# EAGLE design Jetson Nano without CAN (EAGLE 9.6.2)
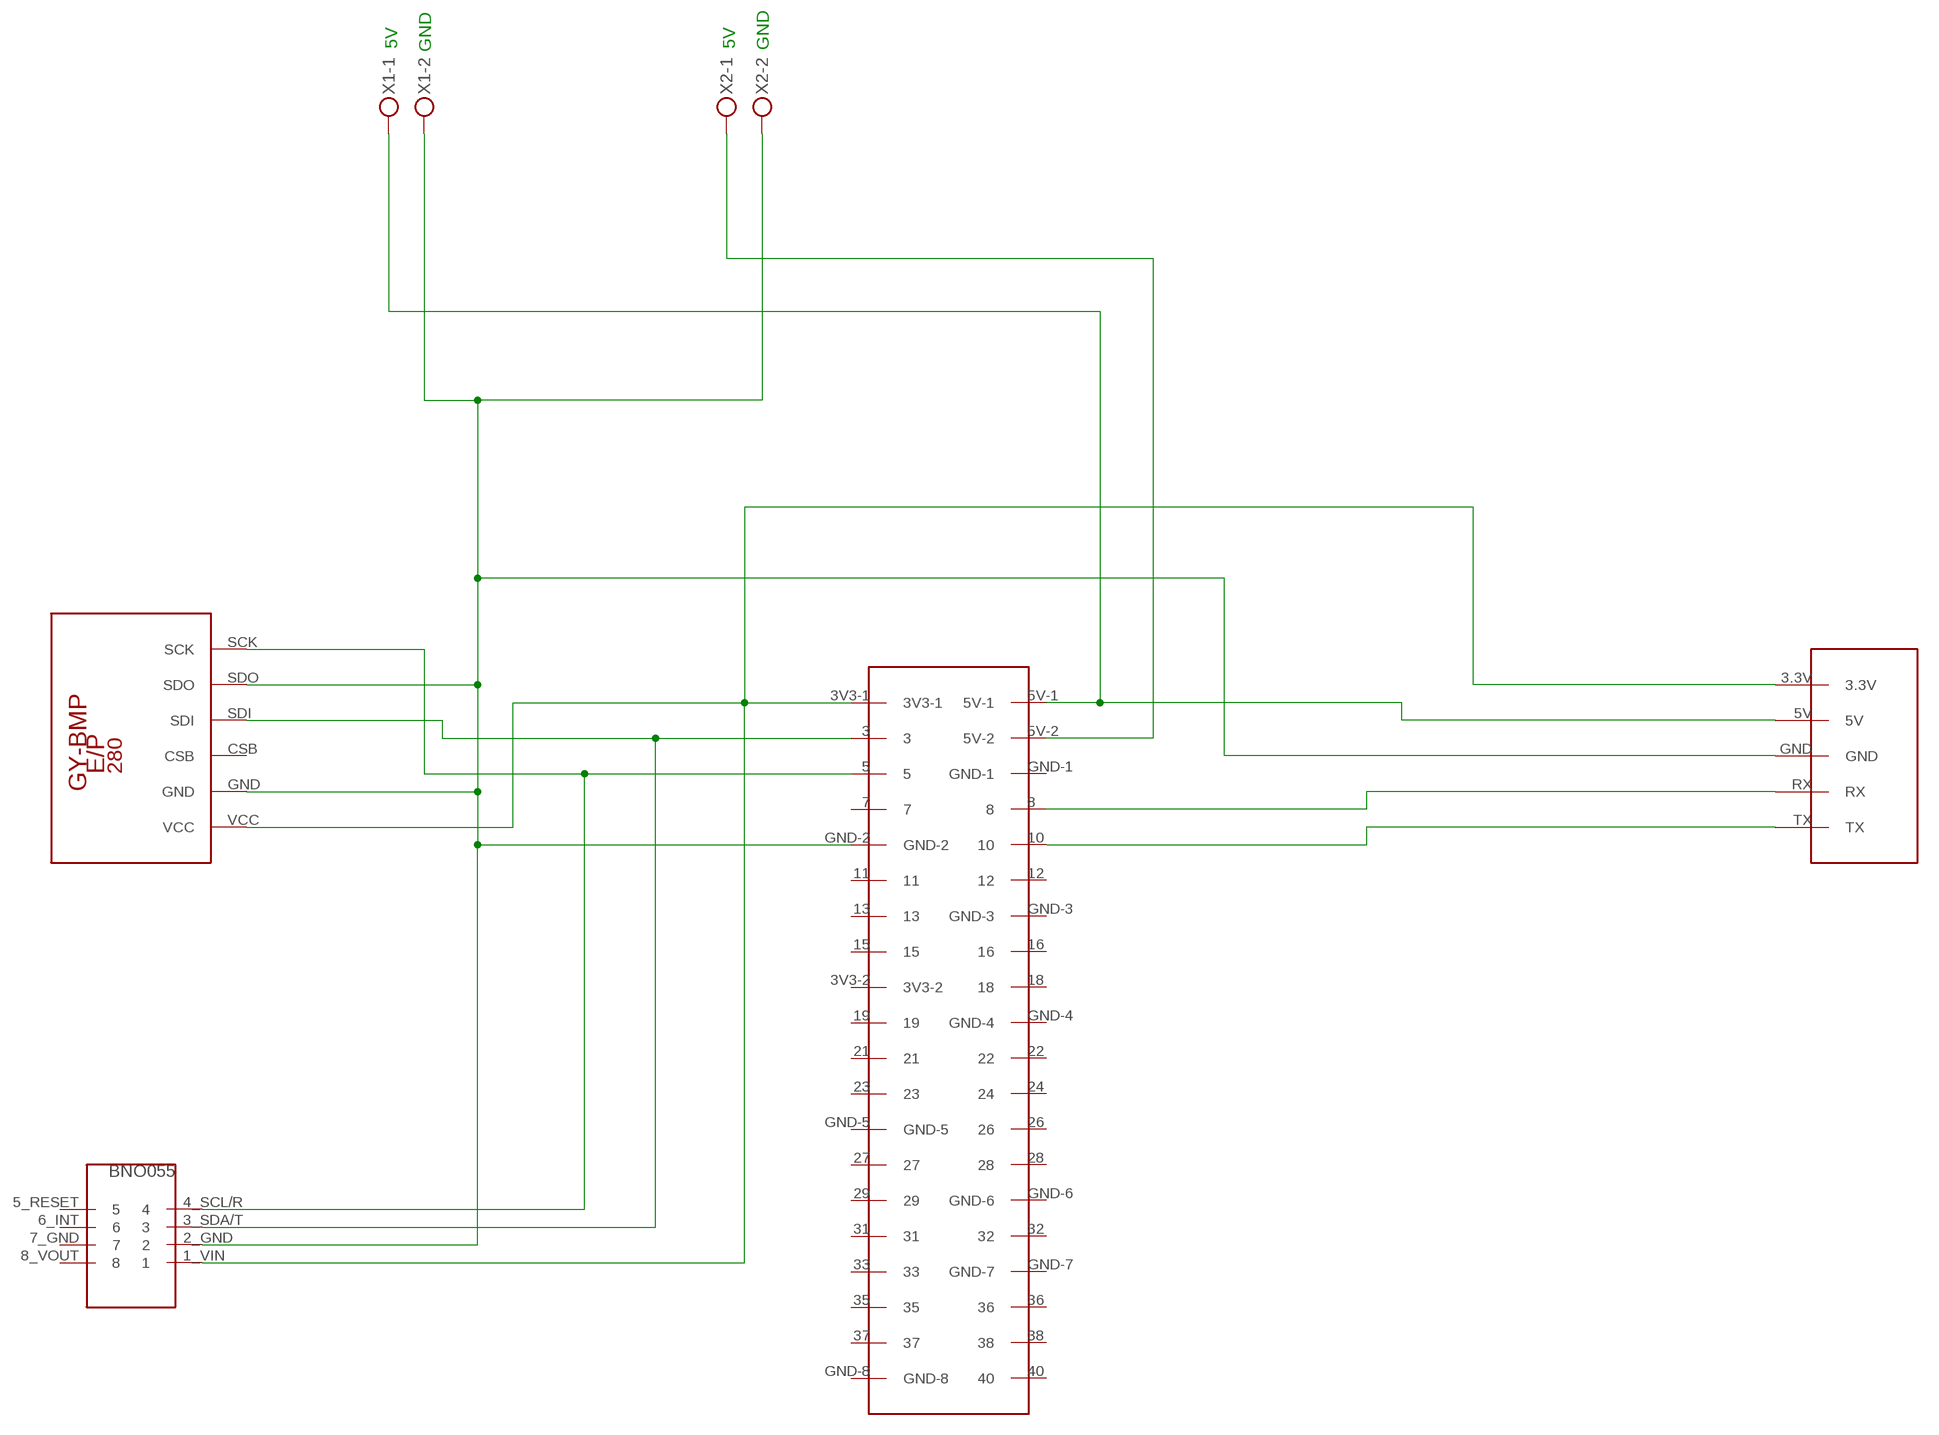
[diagram p0: schematic, sheet 1]

## Parts
JN1  JETSON_NANO  [JETSON_NANO]
U$1  GY-BPM280  [GY-BMP280-FOOTPRINT]
U$2  BNO055  [BNO055]
U$3  WIRELESS_PINS  [WIRELESS_PINS]
X1  MKDSN1,5/4-5,08  [MKDSN1,5/4-5,08]
X2  MKDSN1,5/4-5,08  [MKDSN1,5/4-5,08]

## Nets
5V_1 [PW]: JN1.5V-1 U$3.5V X1.1
5V_2 [PW]: JN1.5V-2 X2.1
N$1: JN1.3V3-1 U$1.VCC U$2.1_VIN U$3.3.3V
N$2: JN1.GND-2 U$1.GND U$1.SDO U$2.2_GND U$3.GND X1.2 X2.2
N$3: JN1.3 U$1.SDI U$2.3_SDA/T
N$4: JN1.5 U$1.SCK U$2.4_SCL/R
N$11: JN1.8 U$3.RX
N$12: JN1.10 U$3.TX
Unconnected: JN1.3V3-2 JN1.7 JN1.11 JN1.12 JN1.13 JN1.15 JN1.16 JN1.18 JN1.19 JN1.21 JN1.22 JN1.23 JN1.24 JN1.26 JN1.27 JN1.28 JN1.29 JN1.31 JN1.32 JN1.33 JN1.35 JN1.36 JN1.37 JN1.38 JN1.40 JN1.GND-1 JN1.GND-3 JN1.GND-4 JN1.GND-5 JN1.GND-6 JN1.GND-7 JN1.GND-8 U$1.CSB U$2.5_RESET U$2.6_INT U$2.7_GND U$2.8_VOUT X1.3 X1.4 X2.3 X2.4

## Notes on the sheet
- 5V | GND | 5V | GND

## Library data of the parts
JN1 = Jetson_Nano_GPIO:JETSON_NANO: Jetson Nano GPIO
U$1 = BMP280:GY-BPM280
U$2 = BNO055:BNO055
U$3 = Wireless_Pins:WIRELESS_PINS
X1 X2 = con-phoenix-508:MKDSN1,5/4-5,08: MKDSN 1,5/ 4-5,08 Printklemme Nennstrom: 13,5 A Nennspannung: 250 V Rastermaß: 5,08 mm Polzahl: 4 Anschlussart: Schraubanschluss Montage: Löten Anschlussrichtung Leiter/Platine: 0 ° Artikelnummer: 1729144 Source: http://eshop.phoenixcontact.com .. 1729144.pdf

## Net classes
0 default: width 0.762 mm, clearance 0.254 mm
1 PW: width 2.032 mm, clearance 0.66 mm

## Board
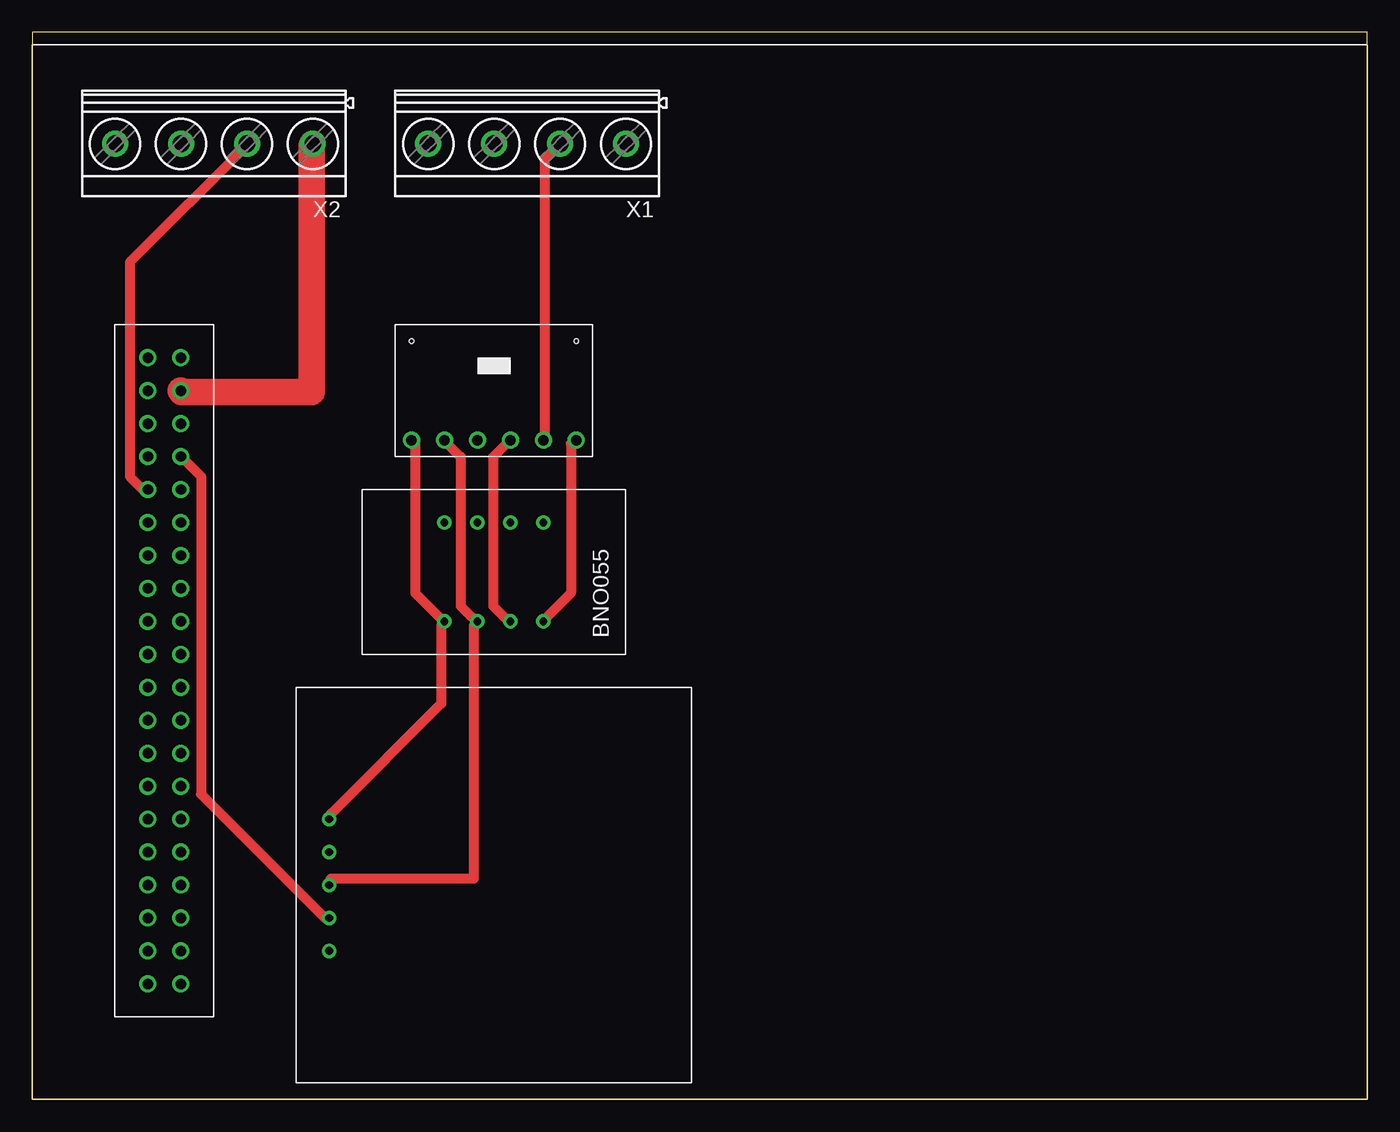
[diagram p1: board, top side]
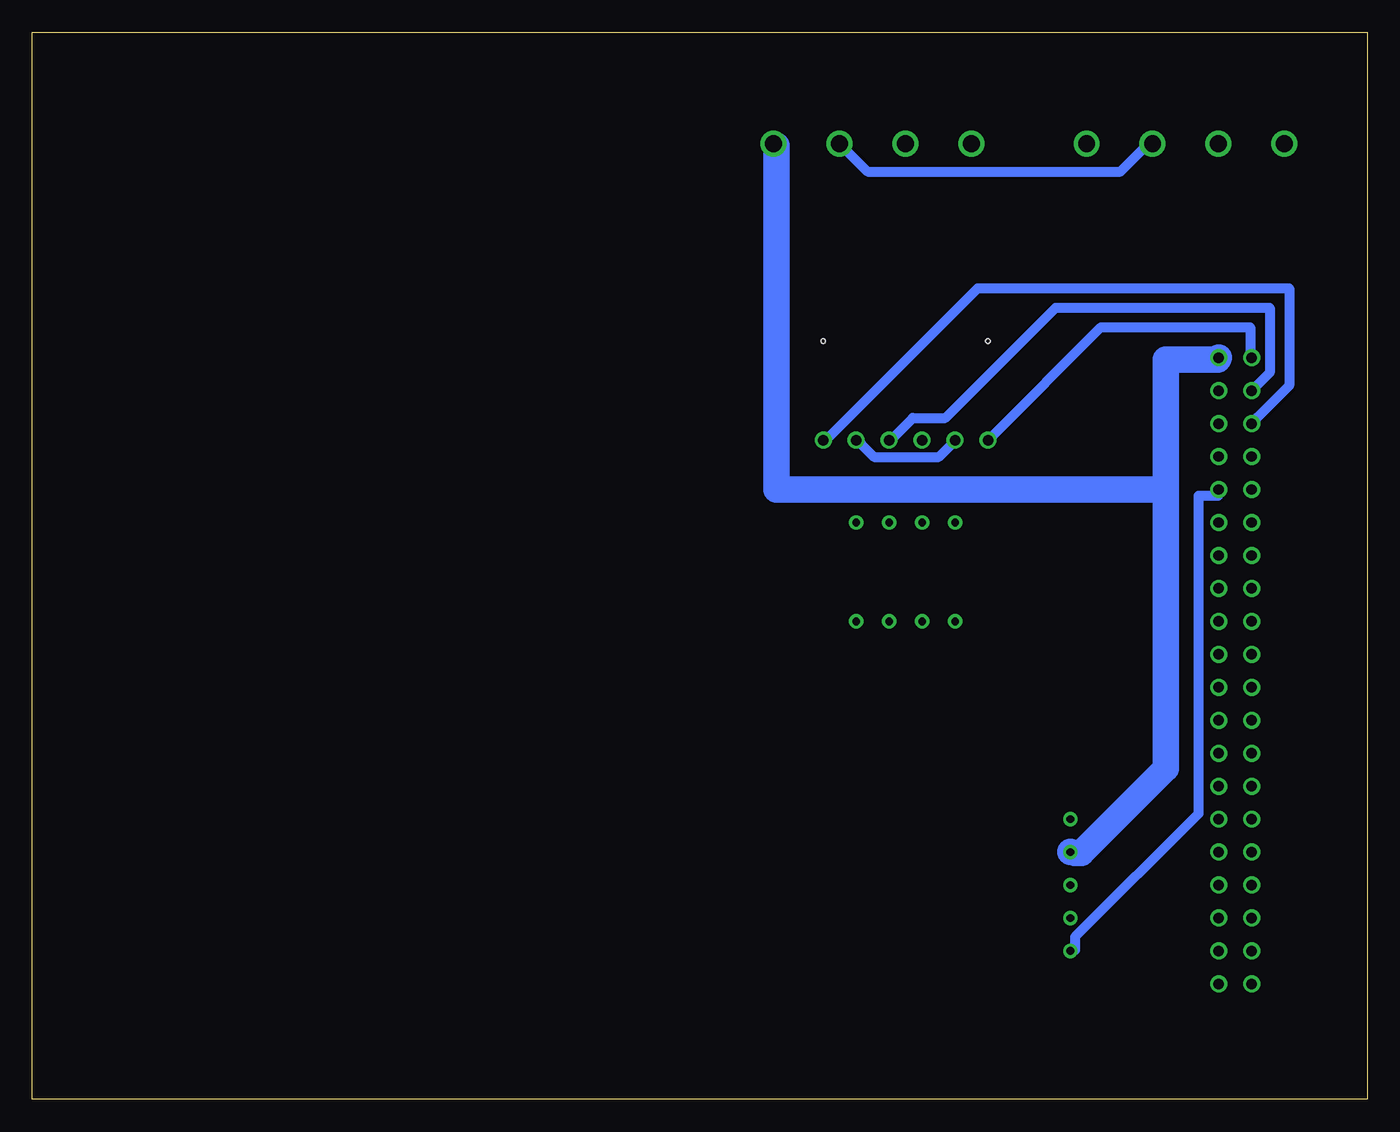
[diagram p2: board, bottom side, seen from below]

Size 102.85 x 82.22 mm. Coordinates in mm from the lower left corner, seen from the top.
Outline: 0,0 102.85,0 102.85,82.22 0,82.22 0,0
Copper layers (1*16): Top 0.035mm / dielectric 1.5mm / Bottom 0.035mm
Design rules "default": minimum track width 6mil, minimum drill 0.35mm, track to track 6mil, track to pad 6mil, pad to pad 6mil, via to via 6mil, smd to smd 6mil, copper to edge 40mil, drill to drill 6mil, minimum pad ring 10mil, minimum via ring 8mil, stop-mask expansion 4mil, vias tented up to drill 0mil, thermal gap 10mil

### Footprints (pad centres in the part's own frame; a part is rotated, then mirrored left to right if it is on the bottom)
JETSON_NANO = drill 0.8: 3 0,45.72; 3V3-1 0,48.26; 3V3-2 0,27.94; 5 0,43.18; 5V-1 2.54,48.26; 5V-2 2.54,45.72; 7 0,40.64; 8 2.54,40.64; 10 2.54,38.1; 11 0,35.56; 12 2.54,35.56; 13 0,33.02; 15 0,30.48; 16 2.54,30.48; 18 2.54,27.94; 19 0,25.4; 21 0,22.86; 22 2.54,22.86; 23 0,20.32; 24 2.54,20.32; 26 2.54,17.78; 27 0,15.24; 28 2.54,15.24; 29 0,12.7; 31 0,10.16; 32 2.54,10.16; 33 0,7.62; 35 0,5.08; 36 2.54,5.08; 37 0,2.54; 38 2.54,2.54; 40 2.54,0; GND-1 2.54,43.18; GND-2 0,38.1; GND-3 2.54,33.02; GND-4 2.54,25.4; GND-5 0,17.78; GND-6 2.54,12.7; GND-7 2.54,7.62; GND-8 0,0
GY-BMP280-FOOTPRINT = drill 0.8: CSB 6.35,0; GND 3.81,0; SCK 13.97,0; SDI 8.89,0; SDO 11.43,0; VCC 1.27,0 | hole 0.35: 1.27,7.62; 13.97,7.62
BNO055 = drill 0.6: 1_VIN 6.35,1.27; 2_GND 8.89,1.27; 3_SDA/T 11.43,1.27; 4_SCL/R 13.97,1.27; 5_RESET 13.97,8.89; 6_INT 11.43,8.89; 7_GND 8.89,8.89; 8_VOUT 6.35,8.89
WIRELESS_PINS = drill 0.6: 3.3V -5.08,0; 5V -2.54,0; GND 0,0; RX 2.54,0; TX 5.08,0
MKDSN1,5/4-5,08 = drill 1.3 pad 2: 1 -7.641,0.025; 2 -2.561,0.025; 3 2.519,0.025; 4 7.599,0.025

### Placement (x,y rotation side)
JN1  8.89,8.89 0 top
U$1  27.94,50.8 0 top
U$2  25.4,35.56 0 top
U$3  22.86,16.51 270 top
X1  38.1,73.66 180 top
X2  13.97,73.66 180 top

### Tracks (layer width: path | path; a pad name or v marks a point on that pad's centre or on a via)
5V_1
  Bottom 2.032: 15.5,47 15.5,57 11.5,57 JN1.5V-1 | 15.5,47 15.5,25.5 22,19 22.5,19 U$3.5V | 15.5,47 45.5,47 45.5,73.5 X1.1
5V_2
  Top 2.032: JN1.5V-2 11.5,54.5 21.5,54.5 21.5,73.5 X2.1
N$1
  Top 0.762: U$3.3.3V 23,22 31.5,30.5 31.5,36.5 U$2.1_VIN 31.5,37 29.5,39 29.5,50.5 U$1.VCC
  Bottom 0.762: JN1.3V3-1 9,57.5 9,59.5 20.5,59.5 29,51 U$1.VCC
N$2
  Top 0.762: JN1.GND-2 8.5,47 7.5,48 7.5,64.5 16.5,73.5 X2.2 | U$3.GND 23,17 34,17 34,36.5 U$2.2_GND 34,37 33,38 33,49.5 32,50.5 U$1.GND | X1.2 40.5,73.5 39.5,72.5 39.5,51 U$1.SDO
  Bottom 0.762: U$1.GND 32,50.5 33,49.5 38,49.5 39,50.5 U$1.SDO | X2.2 17,73.5 19,71.5 38.5,71.5 40.5,73.5 X1.2
N$3
  Top 0.762: U$2.3_SDA/T 36.5,37 35.5,38 35.5,49.5 36.5,50.5 U$1.SDI
  Bottom 0.762: JN1.3 7.5,56 7.5,61 24,61 32.5,52.5 35,52.5 36.5,51 U$1.SDI
N$4
  Top 0.762: U$2.4_SCL/R 39.5,37 41.5,39 41.5,50.5 U$1.SCK
  Bottom 0.762: JN1.5 8.5,52.5 6,55 6,62.5 30,62.5 41.5,51 U$1.SCK
N$11
  Top 0.762: U$3.RX 22.5,14 13,23.5 13,48 11.5,49.5 JN1.8
N$12
  Bottom 0.762: U$3.TX 22.5,11.5 22.5,12.5 13,22 13,46.5 11.5,46.5 JN1.10